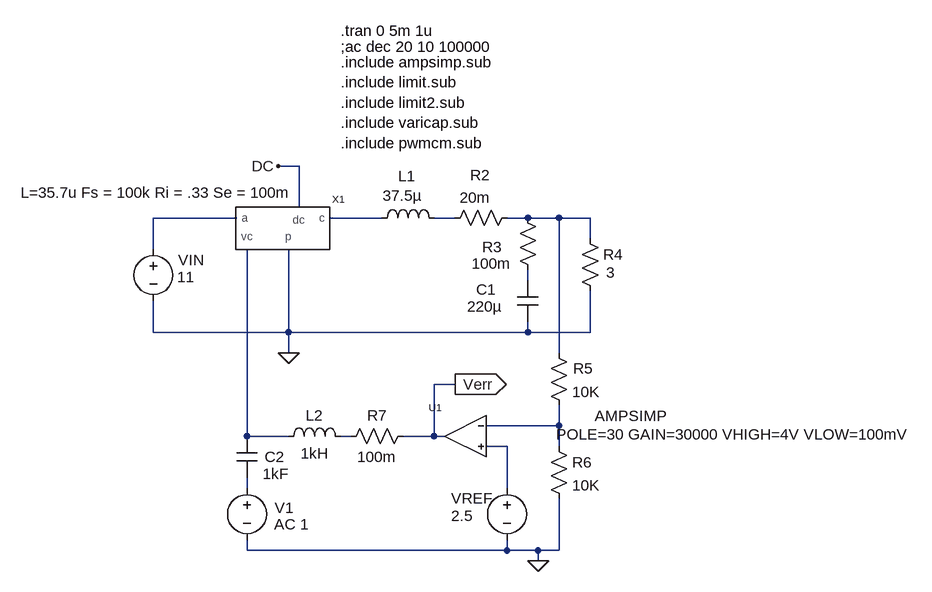
[diagram p0: schematic cm.asc]
cm.asc, the LTspice schematic file:
Version 4
SHEET 1 940 708
WIRE -1536 -1600 -1568 -1600
WIRE -1536 -1536 -1536 -1600
WIRE -1632 -1520 -1760 -1520
WIRE -1408 -1520 -1488 -1520
WIRE -1296 -1520 -1328 -1520
WIRE -1184 -1520 -1216 -1520
WIRE -1136 -1520 -1184 -1520
WIRE -1088 -1520 -1136 -1520
WIRE -1088 -1488 -1088 -1520
WIRE -1760 -1472 -1760 -1520
WIRE -1184 -1424 -1184 -1440
WIRE -1760 -1344 -1760 -1392
WIRE -1552 -1344 -1552 -1472
WIRE -1552 -1344 -1760 -1344
WIRE -1184 -1344 -1184 -1360
WIRE -1184 -1344 -1552 -1344
WIRE -1088 -1344 -1088 -1408
WIRE -1088 -1344 -1184 -1344
WIRE -1552 -1312 -1552 -1344
WIRE -1136 -1312 -1136 -1520
WIRE -1296 -1264 -1328 -1264
WIRE -1136 -1200 -1136 -1232
WIRE -1136 -1200 -1248 -1200
WIRE -1616 -1184 -1616 -1472
WIRE -1552 -1184 -1616 -1184
WIRE -1456 -1184 -1472 -1184
WIRE -1328 -1184 -1328 -1264
WIRE -1328 -1184 -1376 -1184
WIRE -1312 -1184 -1328 -1184
WIRE -1216 -1168 -1248 -1168
WIRE -1136 -1168 -1136 -1200
WIRE -1616 -1104 -1616 -1120
WIRE -1216 -1104 -1216 -1168
WIRE -1616 -1008 -1616 -1024
WIRE -1216 -1008 -1216 -1024
WIRE -1216 -1008 -1616 -1008
WIRE -1168 -1008 -1216 -1008
WIRE -1136 -1008 -1136 -1088
WIRE -1136 -1008 -1168 -1008
WIRE -1168 -992 -1168 -1008
FLAG -1568 -1600 DC
FLAG -1168 -992 0
FLAG -1296 -1264 Verr
IOPIN -1296 -1264 Out
FLAG -1552 -1312 0
SYMBOL Misc\\PWMCM -1584 -1488 R0
WINDOW 39 -380 -71 Left 0
SYMATTR SpiceLine L=35.7u Fs = 100k Ri = .33 Se = 100m
SYMATTR InstName X1
SYMATTR Prefix X
SYMATTR Value PWMCM
SYMBOL voltage -1760 -1488 R0
WINDOW 0 38 33 Left 0
WINDOW 3 37 59 Left 0
WINDOW 123 0 0 Left 0
WINDOW 39 0 0 Left 0
SYMATTR InstName VIN
SYMATTR Value 11
SYMBOL voltage -1216 -1120 R0
WINDOW 0 -86 32 Left 0
WINDOW 3 -86 59 Left 0
WINDOW 123 0 0 Left 0
WINDOW 39 0 0 Left 0
SYMATTR InstName VREF
SYMATTR Value 2.5
SYMBOL ind -1424 -1504 R270
WINDOW 0 65 54 VTop 0
WINDOW 3 66 47 VBottom 0
SYMATTR InstName L1
SYMATTR Value 37.5µ
SYMBOL res -1312 -1504 R270
WINDOW 0 66 55 VTop 0
WINDOW 3 63 47 VBottom 0
SYMATTR InstName R2
SYMATTR Value 20m
SYMBOL res -1200 -1536 R0
WINDOW 0 -54 61 Left 0
WINDOW 3 -70 86 Left 0
SYMATTR InstName R3
SYMATTR Value 100m
SYMBOL cap -1200 -1424 R0
WINDOW 0 -63 14 Left 0
WINDOW 3 -77 40 Left 0
SYMATTR InstName C1
SYMATTR Value 220µ
SYMBOL res -1104 -1504 R0
WINDOW 3 41 68 Left 0
SYMATTR Value 3
SYMATTR InstName R4
SYMBOL res -1152 -1328 R0
WINDOW 0 38 40 Left 0
SYMATTR InstName R5
SYMATTR Value 10K
SYMBOL res -1152 -1184 R0
SYMATTR InstName R6
SYMATTR Value 10K
SYMBOL Misc\\ampsimp -1280 -1184 M0
WINDOW 3 -309 -31 Left 0
WINDOW 39 -686 -3 Left 0
SYMATTR InstName U1
SYMATTR SpiceModel ""
SYMATTR Value AMPSIMP
SYMATTR SpiceLine POLE=30 GAIN=30000 VHIGH=4V VLOW=100mV
SYMBOL ind -1568 -1168 R270
WINDOW 0 32 56 VTop 0
WINDOW 3 5 56 VBottom 0
SYMATTR InstName L2
SYMATTR Value 1kH
SYMBOL res -1472 -1168 R270
WINDOW 0 32 56 VTop 0
WINDOW 3 0 56 VBottom 0
SYMATTR InstName R7
SYMATTR Value 100m
SYMBOL voltage -1616 -1120 R0
WINDOW 0 43 46 Left 0
WINDOW 3 39 73 Left 0
WINDOW 123 42 72 Left 0
WINDOW 39 0 0 Left 0
SYMATTR InstName V1
SYMATTR Value ""
SYMATTR Value2 AC 1
SYMBOL cap -1632 -1184 R0
WINDOW 0 43 32 Left 0
WINDOW 3 40 58 Left 0
SYMATTR InstName C2
SYMATTR Value 1kF
TEXT -1472 -1760 Left 0 !.include ampsimp.sub\n.include limit.sub\n.include limit2.sub\n.include varicap.sub\n.include pwmcm.sub
TEXT -1472 -1784 Left 0 !;ac dec 20 10 100000
TEXT -1472 -1808 Left 0 !.tran 0 5m 1u

The netlist it stands for:
* cm.asc
XX1 N001 N002 0 N007 DC PWMCM L=35.7u Fs = 100k Ri = .33 Se = 100m  ; pins a c p vc dc
VIN N001 0 11
VREF N009 0 2.5
L1 N002 N003 37.5µ
R2 N003 N004 20m
R3 N004 N005 100m
C1 N005 0 220µ
R4 N004 0 3
R5 N004 N006 10K
R6 N006 0 10K
XU1 N009 N006 Verr AMPSIMP POLE=30 GAIN=30000 VHIGH=4V VLOW=100mV  ; pins In+ In- OUT
L2 N007 N008 1kH
R7 N008 Verr 100m
V1 N010 0 AC 1
C2 N007 N010 1kF
.include ampsimp.sub
.include limit.sub
.include limit2.sub
.include varicap.sub
.include pwmcm.sub
;ac dec 20 10 100000
.tran 0 5m 1u
.backanno
.end